# EAGLE design spoke-servo (EAGLE 5.10)
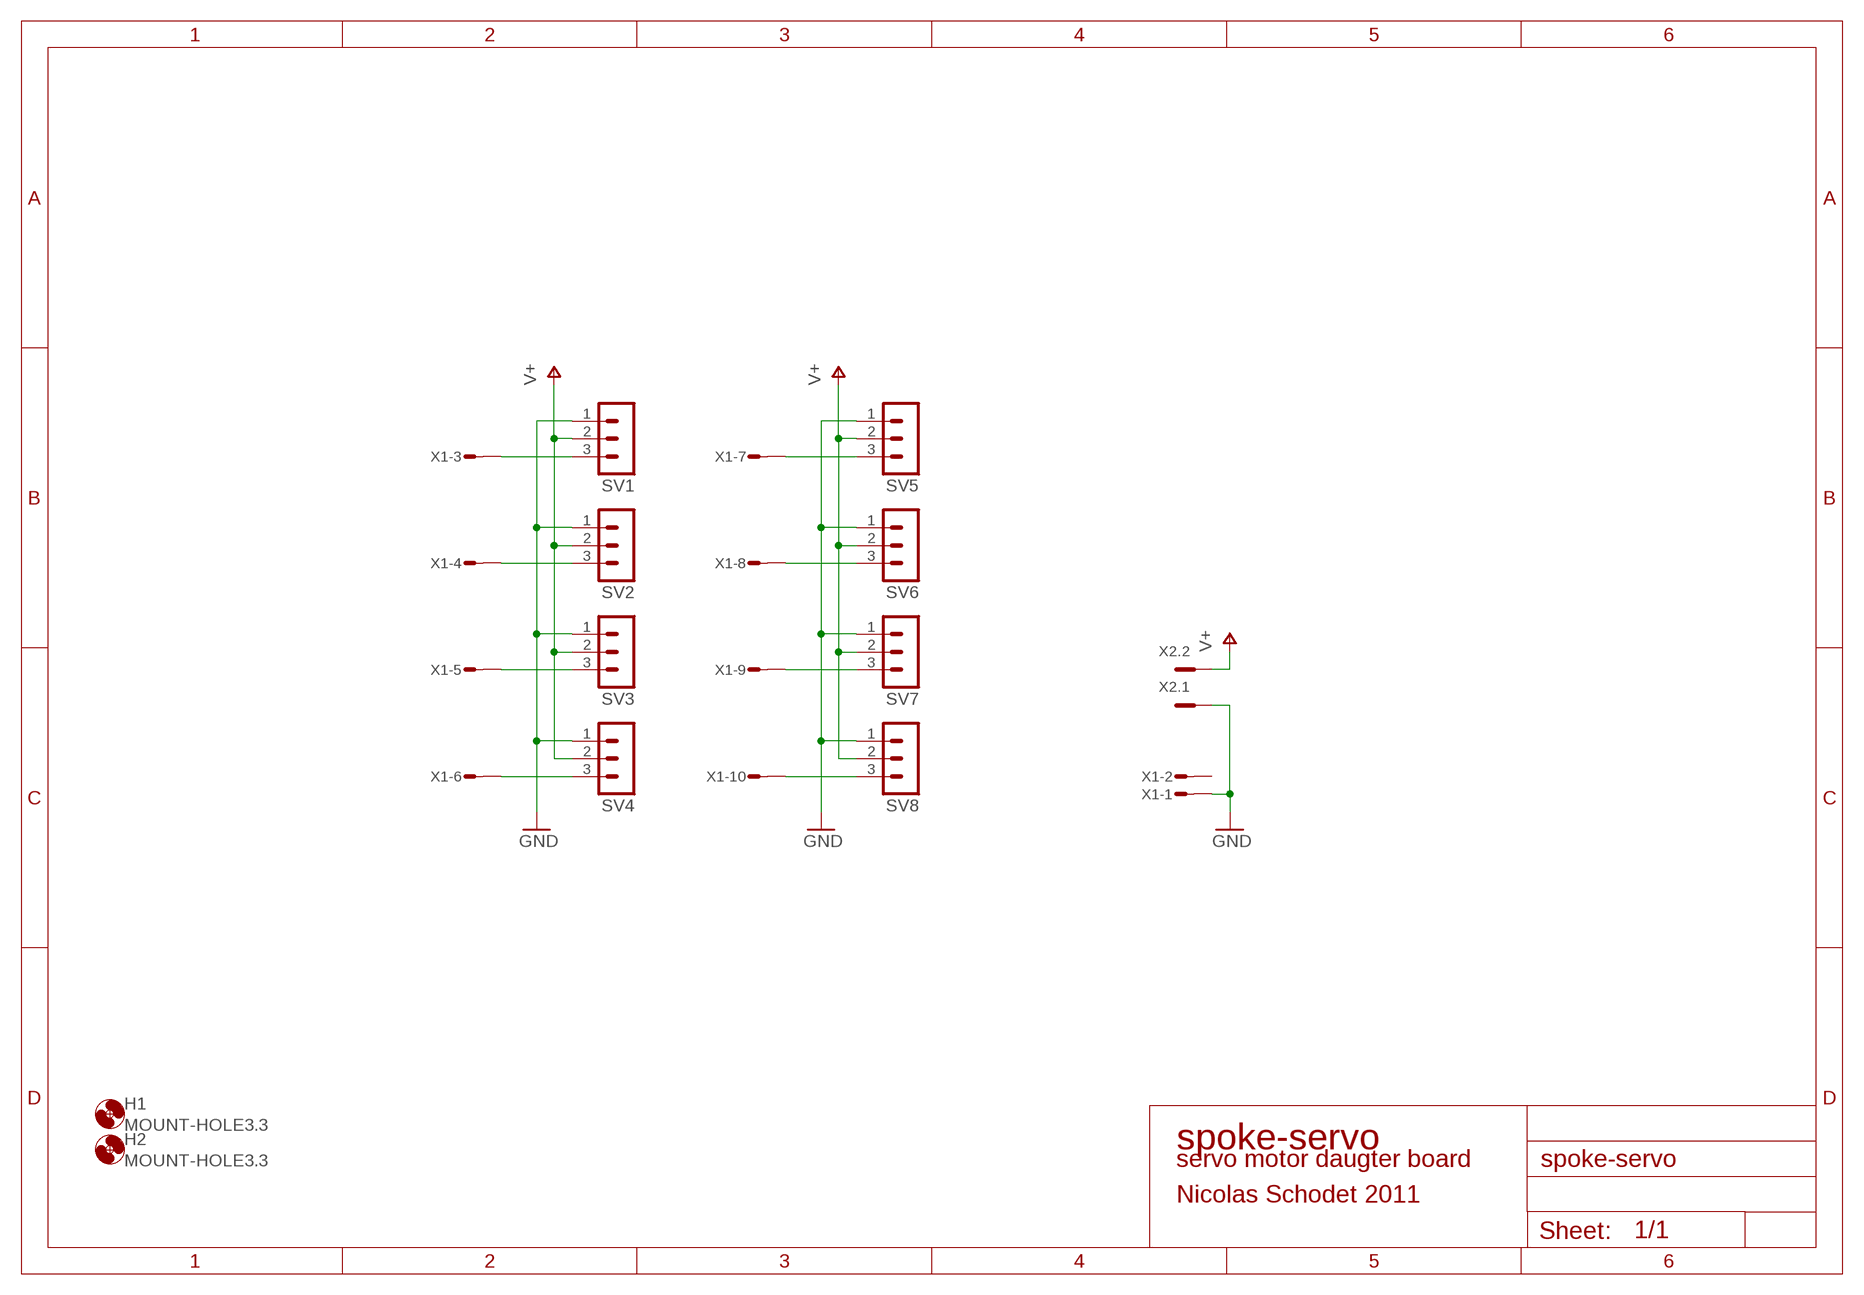
[diagram p0: schematic, sheet 1]

## Parts
H1  MOUNT-HOLE3.3  [3,3]
H2  MOUNT-HOLE3.3  [3,3]
SV1  MA03-1  [MA03-1]
SV2  MA03-1  [MA03-1]
SV3  MA03-1  [MA03-1]
SV4  MA03-1  [MA03-1]
SV5  MA03-1  [MA03-1]
SV6  MA03-1  [MA03-1]
SV7  MA03-1  [MA03-1]
SV8  MA03-1  [MA03-1]
X1  MICROMATCH-10  [MICROMATCH-10]
X2  MC2  [MC2]

## Nets
GND [supply]: SV1.1 SV2.1 SV3.1 SV4.1 SV5.1 SV6.1 SV7.1 SV8.1 X1.1 X2.1
N$1: SV1.3 X1.3
N$2: SV2.3 X1.4
N$3: SV3.3 X1.5
N$4: SV4.3 X1.6
N$5: SV5.3 X1.7
N$6: SV6.3 X1.8
N$7: SV7.3 X1.9
N$8: SV8.3 X1.10
V+: SV1.2 SV2.2 SV3.2 SV4.2 SV5.2 SV6.2 SV7.2 SV8.2 X2.2
Unconnected: X1.2

## Notes on the sheet
- spoke-servo
- servo motor daugter board
- Nicolas Schodet 2011

## Library data of the parts
H1 H2 = holes:MOUNT-HOLE: MOUNTING HOLE with drill center marker
SV1-SV8 = con-lstb:MA03-1: PIN HEADER
X1 = apbteam_con-amp-micromatch:MICROMATCH-10: MicroMaTch 10
X2 = con-phoenix-381_l:MC2: Mini-Combicon 3.81mm horizontal 2-polig MC 1,5/2-G-3,81 Artikel-Nr. 1803277

## Net classes
1 supply: width 0.254 mm

## Board
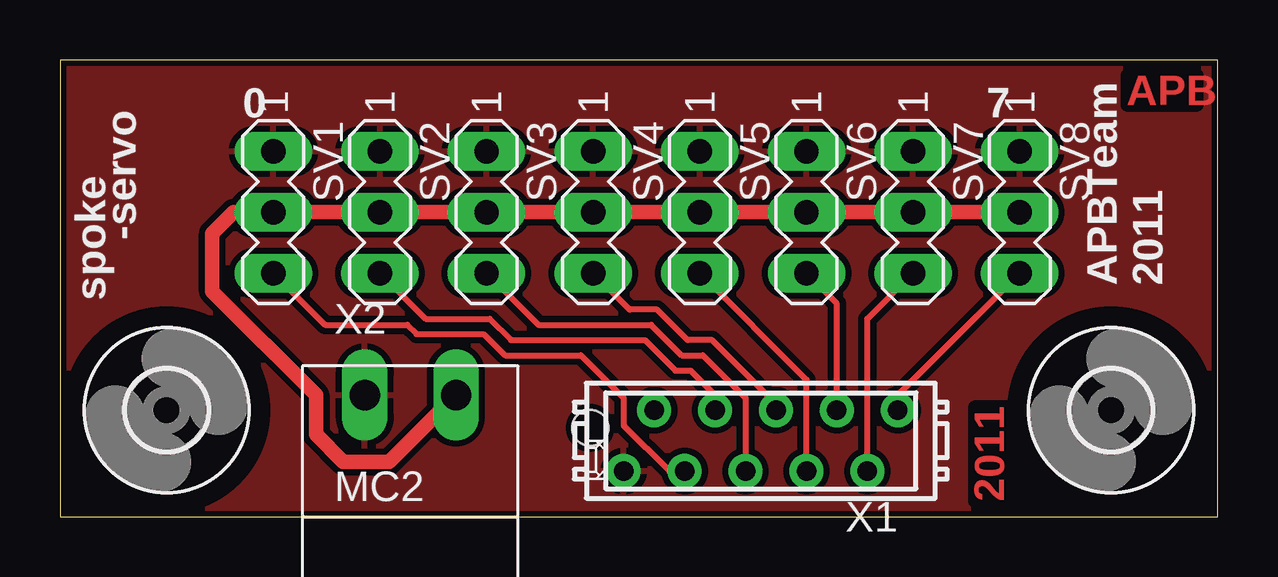
[diagram p1: board, top side]
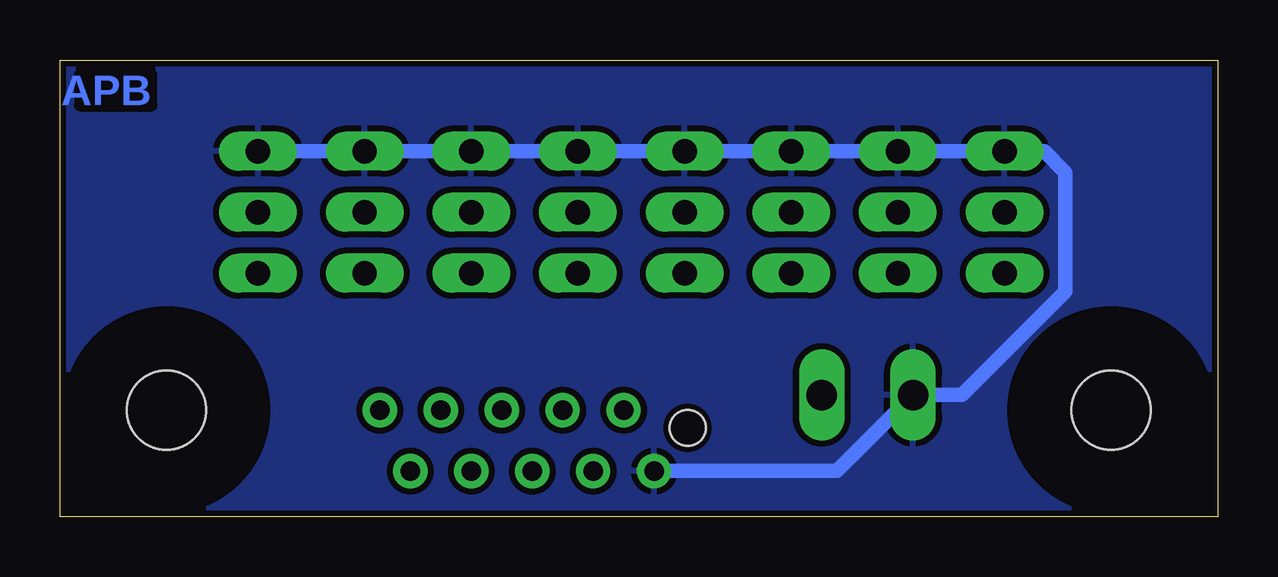
[diagram p2: board, bottom side, seen from below]

Size 48.26 x 19.05 mm. Coordinates in mm from the lower left corner, seen from the top.
Outline: 0,0 48.26,0 48.26,19.05 0,19.05 0,0
Copper layers (1*16): Top 0.035mm / dielectric 1.5mm / Bottom 0.035mm
Design rules "SparkFun": minimum track width 8mil, minimum drill 20mil, track to track 8mil, track to pad 8mil, pad to pad 8mil, via to via 8mil, smd to smd 8mil, copper to edge 10mil, drill to drill 8mil, minimum pad ring 12mil, minimum via ring 10mil, stop-mask expansion 4mil, vias tented up to drill 25mil, thermal gap 10mil

### Footprints (pad centres in the part's own frame; a part is rotated, then mirrored left to right if it is on the bottom)
3,3 = hole 3.3: 0,0
MA03-1 = drill 1.016 long: 1 -2.54,0; 2 0,0; 3 2.54,0
MICROMATCH-10 = drill 0.813 round: 1 5.715,1.27; 2 4.445,-1.27; 3 3.175,1.27; 4 1.905,-1.27; 5 0.635,1.27; 6 -0.635,-1.27; 7 -1.905,1.27; 8 -3.175,-1.27; 9 -4.445,1.27; 10 -5.715,-1.27 | hole 1.5: 7.11,-0.53
MC2 = drill 1.27 long: 1 -1.905,0; 2 1.905,0

### Placement (x,y rotation side)
H1  4.45,4.45 0 top
H2  43.81,4.45 0 top
SV1  8.89,12.7 270 top
SV2  13.34,12.7 270 top
SV3  17.78,12.7 270 top
SV4  22.23,12.7 270 top
SV5  26.67,12.7 270 top
SV6  31.11,12.7 270 top
SV7  35.56,12.7 270 top
SV8  40.01,12.7 270 top
X1  29.21,3.17 180 top
X2  14.61,5.08 0 top

### Tracks (layer width: path | path; a pad name or v marks a point on that pad's centre or on a via)
GND
  Bottom 0.61: SV8.1 SV7.1 SV6.1 SV5.1 SV4.1 SV3.1 SV2.1 SV1.1 7.24,15.24 6.35,14.35 6.35,9.4 10.67,5.08 X2.1 15.88,1.91 X1.1
  pour Top (isolate 0.254): 0,19.05 48.26,19.05 48.26,0 0,0
  pour Bottom (isolate 0.254): 0,19.05 48.26,19.05 48.26,0 0,0
N$1
  Top 0.254: X1.3 25.4,1.91 23.5,3.81 23.5,4.95 21.72,6.73 18.54,6.73 17.65,7.62 14.86,7.62 14.48,8 11.05,8 SV1.3
N$2
  Top 0.254: X1.4 27.3,5.08 26.29,6.1 25.65,6.1 24.38,7.37 18.8,7.37 17.91,8.26 15.24,8.26 SV2.3
N$3
  Top 0.254: X1.5 28.57,4.95 26.8,6.73 25.91,6.73 24.64,8 19.94,8 SV3.3
N$4
  Top 0.254: SV4.3 23.75,8.64 24.89,8.64 26.16,7.37 27.18,7.37 29.84,4.7 X1.6
N$5
  Top 0.254: X1.7 31.11,5.71 SV5.3
N$6
  Top 0.254: X1.8 32.38,8.89 SV6.3
N$7
  Top 0.254: X1.9 33.66,8.26 SV7.3
N$8
  Top 0.254: X1.10 34.92,5.08 SV8.3
V+
  Top 0.61: SV8.2 SV7.2 SV6.2 SV5.2 SV4.2 SV3.2 SV2.2 SV1.2 7.24,12.7 6.35,11.81 6.35,9.4 10.67,5.08 10.67,3.43 11.81,2.29 13.72,2.29 X2.2

### Text on the board
Top: APB | 2011
Bottom: APB
tSilk: 0 | 7 | -servo | APBTeam | 2011 | spoke